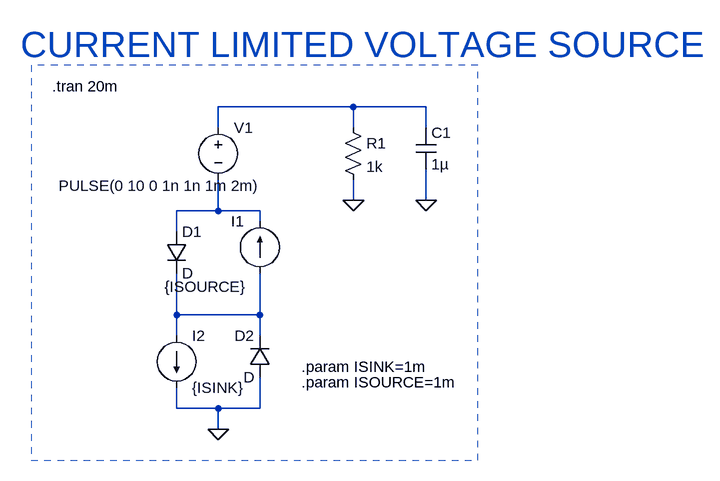
[diagram p0: schematic Current Limited Voltage Source.asc]
Current Limited Voltage Source.asc, the LTspice schematic file:
Version 4
SHEET 1 880 748
WIRE 96 80 -112 80
WIRE 208 80 96 80
WIRE -112 112 -112 80
WIRE 96 112 96 80
WIRE 208 112 208 80
WIRE 96 224 96 192
WIRE 208 224 208 176
WIRE -112 240 -112 192
WIRE -112 240 -176 240
WIRE -48 240 -112 240
WIRE -48 256 -48 240
WIRE -176 272 -176 240
WIRE -176 400 -176 336
WIRE -48 400 -48 336
WIRE -48 400 -176 400
WIRE -176 432 -176 400
WIRE -48 432 -48 400
WIRE -176 544 -176 512
WIRE -112 544 -176 544
WIRE -48 544 -48 496
WIRE -48 544 -112 544
WIRE -112 576 -112 544
FLAG 96 224 0
FLAG 208 224 0
FLAG -112 576 0
SYMBOL voltage -112 96 R0
WINDOW 3 -246 105 Left 2
WINDOW 123 0 0 Left 0
WINDOW 39 0 0 Left 0
SYMATTR InstName V1
SYMATTR Value PULSE(0 10 0 1n 1n 1m 2m)
SYMBOL res 80 96 R0
SYMATTR InstName R1
SYMATTR Value 1k
SYMBOL cap 192 112 R0
SYMATTR InstName C1
SYMATTR Value 1µ
SYMBOL current -48 336 R180
WINDOW 0 24 80 Left 2
WINDOW 3 21 -21 Left 2
SYMATTR InstName I1
SYMATTR Value {ISOURCE}
SYMBOL diode -192 272 R0
SYMATTR InstName D1
SYMBOL current -176 432 R0
SYMATTR InstName I2
SYMATTR Value {ISINK}
SYMBOL diode -32 496 R180
WINDOW 0 24 64 Left 2
WINDOW 3 24 0 Left 2
SYMATTR InstName D2
TEXT 16 480 Left 2 !.param ISINK=1m
TEXT 16 504 Left 2 !.param ISOURCE=1m
TEXT -368 48 Left 2 !.tran 20m
TEXT -416 -16 Left 5 ;CURRENT LIMITED VOLTAGE SOURCE
RECTANGLE Normal 288 16 -400 624 2

The netlist it stands for:
* Current Limited Voltage Source.asc
V1 N001 N002 PULSE(0 10 0 1n 1n 1m 2m)
R1 N001 0 1k
C1 N001 0 1µ
I1 N003 N002 {ISOURCE}
D1 N002 N003 D
I2 N003 0 {ISINK}
D2 0 N003 D
.model D D
.lib standard.dio
.param ISINK=1m
.param ISOURCE=1m
.tran 20m
* CURRENT LIMITED VOLTAGE SOURCE
.backanno
.end